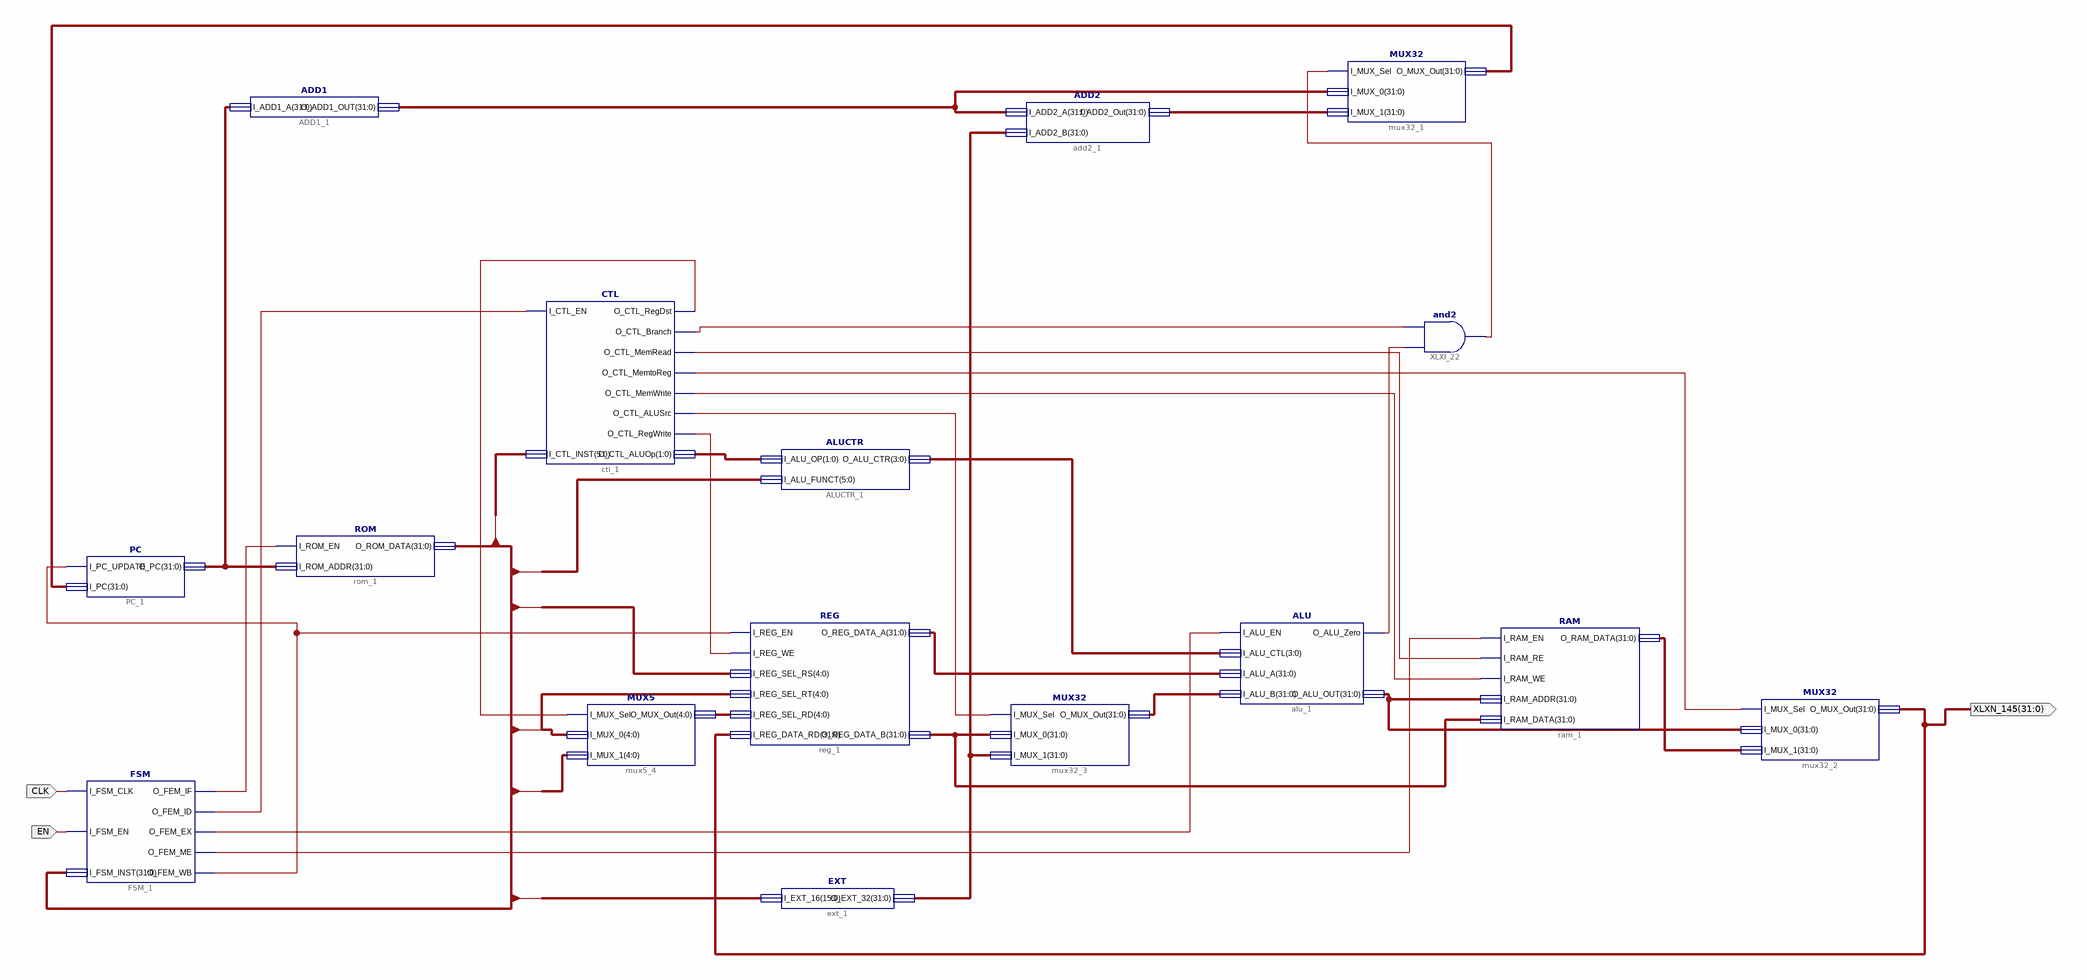
[diagram p0: schematic sheet 1]
// Xilinx ISE schematic Processor.sch (spartan3e) as structural Verilog: 16 symbols, 3 ports
module Processor (
  input  CLK,
  input  EN,
  output [31:0] XLXN_145
);

  wire XLXN_2, XLXN_27, XLXN_35, XLXN_44, XLXN_50, XLXN_86, XLXN_88, XLXN_99, XLXN_108, XLXN_111, XLXN_146,
       XLXN_148, XLXN_149, XLXN_159;
  wire [1:0] XLXN_152;
  wire [3:0] XLXN_151;
  wire [4:0] XLXN_47;
  wire [31:0] instruction, XLXN_10, XLXN_76, XLXN_77, XLXN_82, XLXN_83, XLXN_94, XLXN_97, XLXN_125, XLXN_128,
       XLXN_134;

  FSM FSM_1 (
    .I_FSM_CLK(CLK), .I_FSM_EN(EN), .I_FSM_INST(instruction), .O_FEM_IF(XLXN_27), .O_FEM_ID(XLXN_35),
    .O_FEM_EX(XLXN_88), .O_FEM_ME(XLXN_146), .O_FEM_WB(XLXN_2));
  PC PC_1 (.I_PC_UPDATE(XLXN_2), .I_PC(XLXN_125), .O_PC(XLXN_10));
  ADD1 ADD1_1 (.I_ADD1_A(XLXN_10), .O_ADD1_OUT(XLXN_94));
  CTL ctl_1 (
    .I_CTL_EN(XLXN_35), .I_CTL_INST(instruction[31:26]), .O_CTL_RegDst(XLXN_50), .O_CTL_Branch(XLXN_111),
    .O_CTL_MemRead(XLXN_149), .O_CTL_MemtoReg(XLXN_159), .O_CTL_MemWrite(XLXN_148), .O_CTL_ALUSrc(XLXN_86),
    .O_CTL_RegWrite(XLXN_44), .O_CTL_ALUOp(XLXN_152));
  REG reg_1 (
    .I_REG_EN(XLXN_2), .I_REG_WE(XLXN_44), .I_REG_SEL_RS(instruction[25:21]),
    .I_REG_SEL_RT(instruction[20:16]), .I_REG_SEL_RD(XLXN_47), .I_REG_DATA_RD(XLXN_145),
    .O_REG_DATA_A(XLXN_83), .O_REG_DATA_B(XLXN_76));
  MUX5 mux5_4 (.I_MUX_Sel(XLXN_50), .I_MUX_0(instruction[20:16]), .I_MUX_1(instruction[15:11]), .O_MUX_Out(XLXN_47));
  EXT ext_1 (.I_EXT_16(instruction[15:0]), .O_EXT_32(XLXN_77));
  MUX32 mux32_3 (.I_MUX_Sel(XLXN_86), .I_MUX_0(XLXN_76), .I_MUX_1(XLXN_77), .O_MUX_Out(XLXN_82));
  ALU alu_1 (
    .I_ALU_EN(XLXN_88), .I_ALU_CTL(XLXN_151), .I_ALU_A(XLXN_83), .I_ALU_B(XLXN_82), .O_ALU_Zero(XLXN_108),
    .O_ALU_OUT(XLXN_128));
  ADD2 add2_1 (.I_ADD2_A(XLXN_94), .I_ADD2_B(XLXN_77), .I_ADD2_Out(XLXN_97));
  MUX32 mux32_1 (.I_MUX_Sel(XLXN_99), .I_MUX_0(XLXN_94), .I_MUX_1(XLXN_97), .O_MUX_Out(XLXN_125));
  and XLXI_22 (XLXN_99, XLXN_108, XLXN_111);
  MUX32 mux32_2 (.I_MUX_Sel(XLXN_159), .I_MUX_0(XLXN_128), .I_MUX_1(XLXN_134), .O_MUX_Out(XLXN_145));
  RAM ram_1 (
    .I_RAM_EN(XLXN_146), .I_RAM_RE(XLXN_149), .I_RAM_WE(XLXN_148), .I_RAM_ADDR(XLXN_128),
    .I_RAM_DATA(XLXN_76), .O_RAM_DATA(XLXN_134));
  ALUCTR ALUCTR_1 (.I_ALU_OP(XLXN_152), .I_ALU_FUNCT(instruction[5:0]), .O_ALU_CTR(XLXN_151));
  ROM rom_1 (.I_ROM_EN(XLXN_27), .I_ROM_ADDR(XLXN_10), .O_ROM_DATA(instruction));
endmodule
